# Altium schematic sheet полная схема для ИО.SchDoc
size 420 x 297 mm; Date: 01.01.01; ApprovedBy: Петренко Н.И.; CheckedBy: Шиншилова З.Д.; CompanyName: ЛФВЭ ОИЯИ; Engineer: Люосев Д.А.; DocumentNumber: АБВГ.000000.000; SheetNumber: 1; SheetTotal: 2; Mass: 100; Material: Ясень; NameProduct: Форматка А3; NameProduct_1: Шла Саша по шоссе; NameProduct_2: и сосала сушку; Scale: 1:1; PageSetup: Record=PageOptions|CenterHorizontal=False|CenterVertical=False|PrintScale=1.00|XCorrection=1.00|YCorrection=1.00|PrintKind=0|BorderSize=5000000|LeftOffset=0|BottomOffset=0|Orientation=2|PaperLength=1000|PaperWidth=1000|Scale=100|PaperSource=7|PrintQuality=-3|MediaType=1|DitherType=10|PrintScaleMode=0|PaperKind=A3|PaperIndex=8
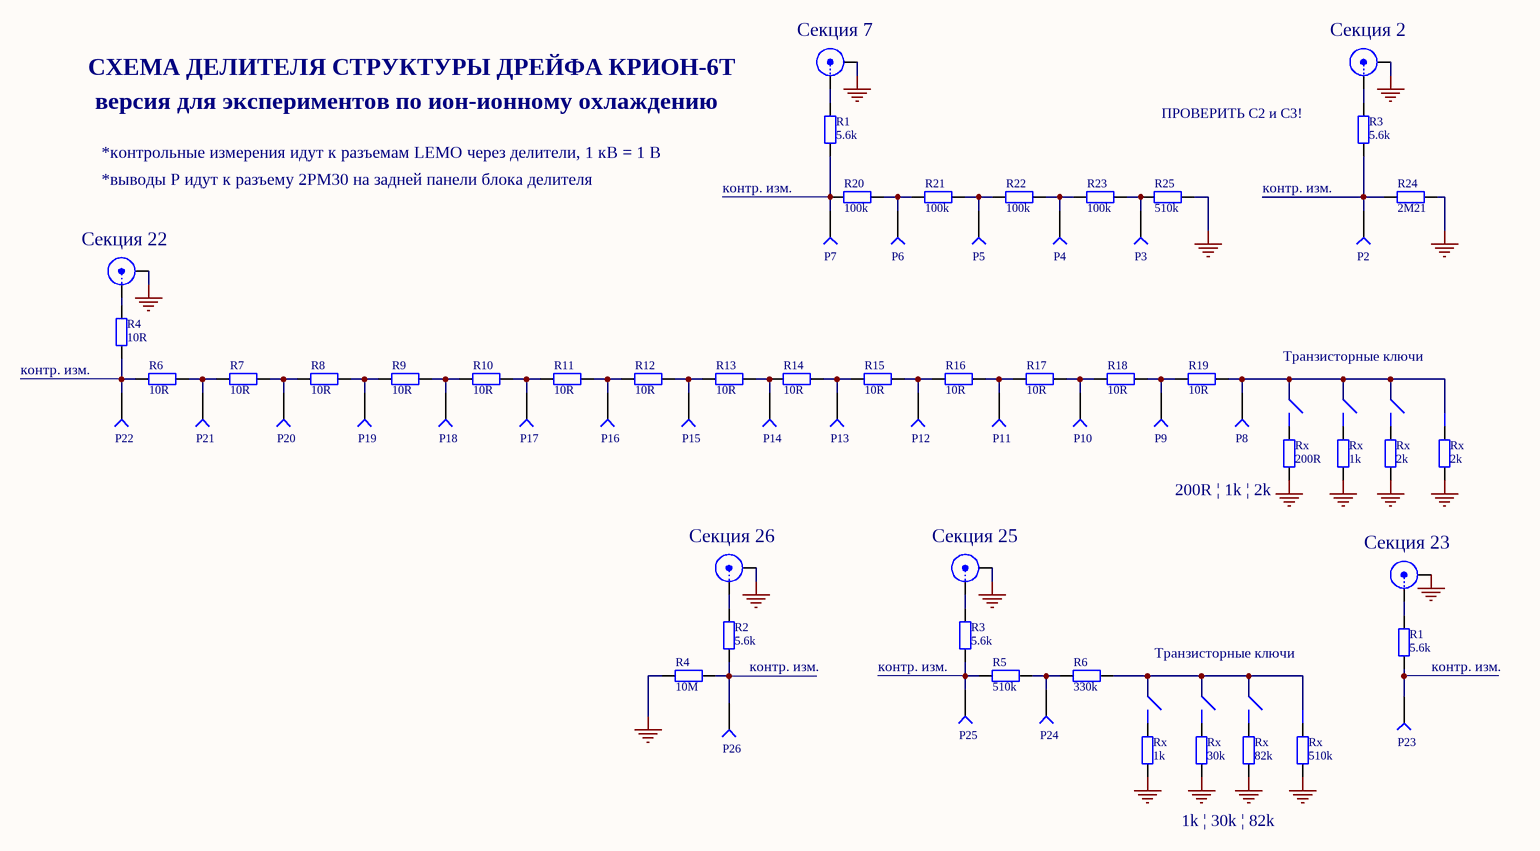
[diagram p0: полная схема для ИО.SchDoc]

## Parts
(Parts that share a designator on the sheet are numbered #1, #2 ... from top to bottom, then left to right.)
P2  (no value)  [Pad 2x5mm]  (no BOM)
P3  (no value)  [Pad 2x5mm]  (no BOM)
P4  (no value)  [Pad 2x5mm]  (no BOM)
P5  (no value)  [Pad 2x5mm]  (no BOM)
P6  (no value)  [Pad 2x5mm]  (no BOM)
P7  (no value)  [Pad 2x5mm]  (no BOM)
P8  (no value)  [Pad 2x5mm]  (no BOM)
P9  (no value)  [Pad 2x5mm]  (no BOM)
P10  (no value)  [Pad 2x5mm]  (no BOM)
P11  (no value)  [Pad 2x5mm]  (no BOM)
P12  (no value)  [Pad 2x5mm]  (no BOM)
P13  (no value)  [Pad 2x5mm]  (no BOM)
P14  (no value)  [Pad 2x5mm]  (no BOM)
P15  (no value)  [Pad 2x5mm]  (no BOM)
P16  (no value)  [Pad 2x5mm]  (no BOM)
P17  (no value)  [Pad 2x5mm]  (no BOM)
P18  (no value)  [Pad 2x5mm]  (no BOM)
P19  (no value)  [Pad 2x5mm]  (no BOM)
P20  (no value)  [Pad 2x5mm]  (no BOM)
P21  (no value)  [Pad 2x5mm]  (no BOM)
P22  (no value)  [Pad 2x5mm]  (no BOM)
P23  (no value)  [Pad 2x5mm]  (no BOM)
P24  (no value)  [Pad 2x5mm]  (no BOM)
P25  (no value)  [Pad 2x5mm]  (no BOM)
P26  (no value)  [Pad 2x5mm]  (no BOM)
R1#1  value 5.6k  [Resistor ТВО-1 1W Horizontal]  (hidden comment: Resistor)
R1#2  5.6k  [Resistor ТВО-1 1W Horizontal]
R2  5.6k  [Resistor ТВО-1 1W Horizontal]
R3#1  value 5.6k  [Resistor ТВО-1 1W Horizontal]  (hidden comment: Resistor)
R3#2  5.6k  [Resistor ТВО-1 1W Horizontal]
R4#1  value 10R  [Resistor ТВО-1 1W Horizontal]  (hidden comment: Resistor)
R4#2  10M  [Resistor ТВО-1 1W Horizontal]
R5  510k  [Resistor ТВО-1 1W Horizontal]
R6#1  value 10R  [Resistor ТВО-1 1W Horizontal]  (hidden comment: Resistor)
R6#2  330k  [Resistor ТВО-1 1W Horizontal]
R7  value 10R  [Resistor ТВО-1 1W Horizontal]  (hidden comment: Resistor)
R8  value 10R  [Resistor ТВО-1 1W Horizontal]  (hidden comment: Resistor)
R9  value 10R  [Resistor ТВО-1 1W Horizontal]  (hidden comment: Resistor)
R10  value 10R  [Resistor ТВО-1 1W Horizontal]  (hidden comment: Resistor)
R11  value 10R  [Resistor ТВО-1 1W Horizontal]  (hidden comment: Resistor)
R12  value 10R  [Resistor ТВО-1 1W Horizontal]  (hidden comment: Resistor)
R13  value 10R  [Resistor ТВО-1 1W Horizontal]  (hidden comment: Resistor)
R14  value 10R  [Resistor ТВО-1 1W Horizontal]  (hidden comment: Resistor)
R15  value 10R  [Resistor ТВО-1 1W Horizontal]  (hidden comment: Resistor)
R16  value 10R  [Resistor ТВО-1 1W Horizontal]  (hidden comment: Resistor)
R17  value 10R  [Resistor ТВО-1 1W Horizontal]  (hidden comment: Resistor)
R18  value 10R  [Resistor ТВО-1 1W Horizontal]  (hidden comment: Resistor)
R19  value 10R  [Resistor ТВО-1 1W Horizontal]  (hidden comment: Resistor)
R20  value 100k  [Resistor ТВО-1 1W Horizontal]  (hidden comment: Resistor)
R21  value 100k  [Resistor ТВО-1 1W Horizontal]  (hidden comment: Resistor)
R22  value 100k  [Resistor ТВО-1 1W Horizontal]  (hidden comment: Resistor)
R23  value 100k  [Resistor ТВО-1 1W Horizontal]  (hidden comment: Resistor)
R24  value 2M21  [Resistor Р1-35-2 1W Horizontal]  (hidden comment: Resistor)
R25  value 510k  [Resistor ТВО-1 1W Horizontal]  (hidden comment: Resistor)
Rx#1  value 200R  [Resistor ТВО-1 1W Horizontal]  (hidden comment: Resistor)
Rx#2  value 1k  [Resistor ТВО-1 1W Horizontal]  (hidden comment: Resistor)
Rx#3  value 2k  [Resistor ТВО-1 1W Horizontal]  (hidden comment: Resistor)
Rx#4  value 2k  [Resistor ТВО-1 1W Horizontal]  (hidden comment: Resistor)
Rx#5  value 1k  [Resistor ТВО-1 1W Horizontal]  (hidden comment: Resistor)
Rx#6  value 30k  [Resistor ТВО-1 1W Horizontal]  (hidden comment: Resistor)
Rx#7  value 82k  [Resistor ТВО-1 1W Horizontal]  (hidden comment: Resistor)
Rx#8  value 510k  [Resistor ТВО-1 1W Horizontal]  (hidden comment: Resistor)
Секция_2  HV-SYS  [HV-SYS]  (value not drawn)
Секция_7  HV-SYS  [HV-SYS]  (value not drawn)
Секция_22  HV-SYS  [HV-SYS]  (value not drawn)
Секция_23  HV-SYS  [HV-SYS]  (value not drawn)
Секция_25  HV-SYS  [HV-SYS]  (value not drawn)
Секция_26  HV-SYS  [HV-SYS]  (value not drawn)

## Nets
GND: R4#2.1 R24.2 R25.1 Rx#1.1 Rx#2.1 Rx#3.1 Rx#4.1 Rx#5.1 Rx#6.1 Rx#7.1 Rx#8.1 Секция_2.2(Y) Секция_7.2(Y) Секция_22.2(Y) Секция_23.2(Y) Секция_25.2(Y) Секция_26.2(Y)
NetP2_1: P2.1 R3#1.1 R24.1
NetP3_1: P3.1 R23.2 R25.2
NetP4_1: P4.1 R22.2 R23.1
NetP5_1: P5.1 R21.2 R22.1
NetP6_1: P6.1 R20.2 R21.1
NetP7_1: P7.1 R1#1.1 R20.1
NetP8_1: P8.1 R19.2
NetP9_1: P9.1 R18.2 R19.1
NetP10_1: P10.1 R17.2 R18.1
NetP11_1: P11.1 R16.2 R17.1
NetP12_1: P12.1 R15.2 R16.1
NetP13_1: P13.1 R14.2 R15.1
NetP14_1: P14.1 R13.2 R14.1
NetP15_1: P15.1 R12.2 R13.1
NetP16_1: P16.1 R11.2 R12.1
NetP17_1: P17.1 R10.2 R11.1
NetP18_1: P18.1 R9.2 R10.1
NetP19_1: P19.1 R8.2 R9.1
NetP20_1: P20.1 R7.2 R8.1
NetP21_1: P21.1 R6#1.2 R7.1
NetP22_1: P22.1 R4#1.1 R6#1.1
NetP23_1: P23.1 R1#2.1
NetP24_1: P24.1 R5.2 R6#2.1
NetP25_1: P25.1 R3#2.1 R5.1
NetP26_1: P26.1 R2.1 R4#2.2
NetR1#1_2: R1#1.2 Секция_7.1(X)
NetR1#2_2: R1#2.2 Секция_23.1(X)
NetR2_2: R2.2 Секция_26.1(X)
NetR3#1_2: R3#1.2 Секция_2.1(X)
NetR3#2_2: R3#2.2 Секция_25.1(X)
NetR4#1_2: R4#1.2 Секция_22.1(X)

Not connected (* = marked no-connect by the designer): R6#2 2; Rx#1 2; Rx#2 2; Rx#3 2; Rx#4 2; Rx#5 2; Rx#6 2; Rx#7 2; Rx#8 2

## Notes on the sheet
- СХЕМА ДЕЛИТЕЛЯ СТРУКТУРЫ ДРЕЙФА КРИОН-6Т
- версия для экспериментов по ион-ионному охлаждению
- ПРОВЕРИТЬ С2 и С3!
- *контрольные измерения идут к разъемам LEMO через делители, 1 кВ = 1 В
- *выводы P идут к разъему 2РМ30 на задней панели блока делителя
- контр. изм.
- (near R4#1) контр. изм.
- Транзисторные ключи
- (near Rx#1) 200R | 1k | 2k
- (near R2) контр. изм.
- (near R3#2) контр. изм.
- (near R1#2) контр. изм.
- (near Rx#6) 1k | 30k | 82k
- Перв. примен.
- Справ. №
- Подп. и дата
- Инв.№дубл.
- Взам.инв.№
- Изм.
- Лист
- № докум.
- Подп.
- Дата
- Лит.
- Масса
- Масштаб
- Разраб.
- Пров.
- Т.контр.
- Листов
- Н.контр.
- Инв. №подл.
- Утв.

## Library data of the parts
P2-P26 = Socket
R1#1 R3#1 R4#1 R6#1 R7-R25 Rx#1-Rx#8 = Resistors: Category: Резисторы; Type: *; Tolerance: *
R1#2 R2 R3#2 R4#2 R5 R6#2 = Resistors: Resistor; Category: Резисторы; Type: *; Tolerance: *
  R1#2 R2 R3#2: Value: 5.6k
  R4#2: Value: 10M
  R5: Value: 510k
  R6#2: Value: 330k
Секция_2 Секция_7 Секция_22 Секция_23 Секция_25 Секция_26 = HV-SYS: LHEP JINR HV SYS 3 kV connector; Coaxial Termination: Through Hole Right Angle; Coaxial Cable Types: -; Category: Разъёмы